# Altium schematic sheet SensorsAndOthers.SchDoc
size A3; DocumentNumber: 4; SheetNumber: 4; SheetTotal: 4
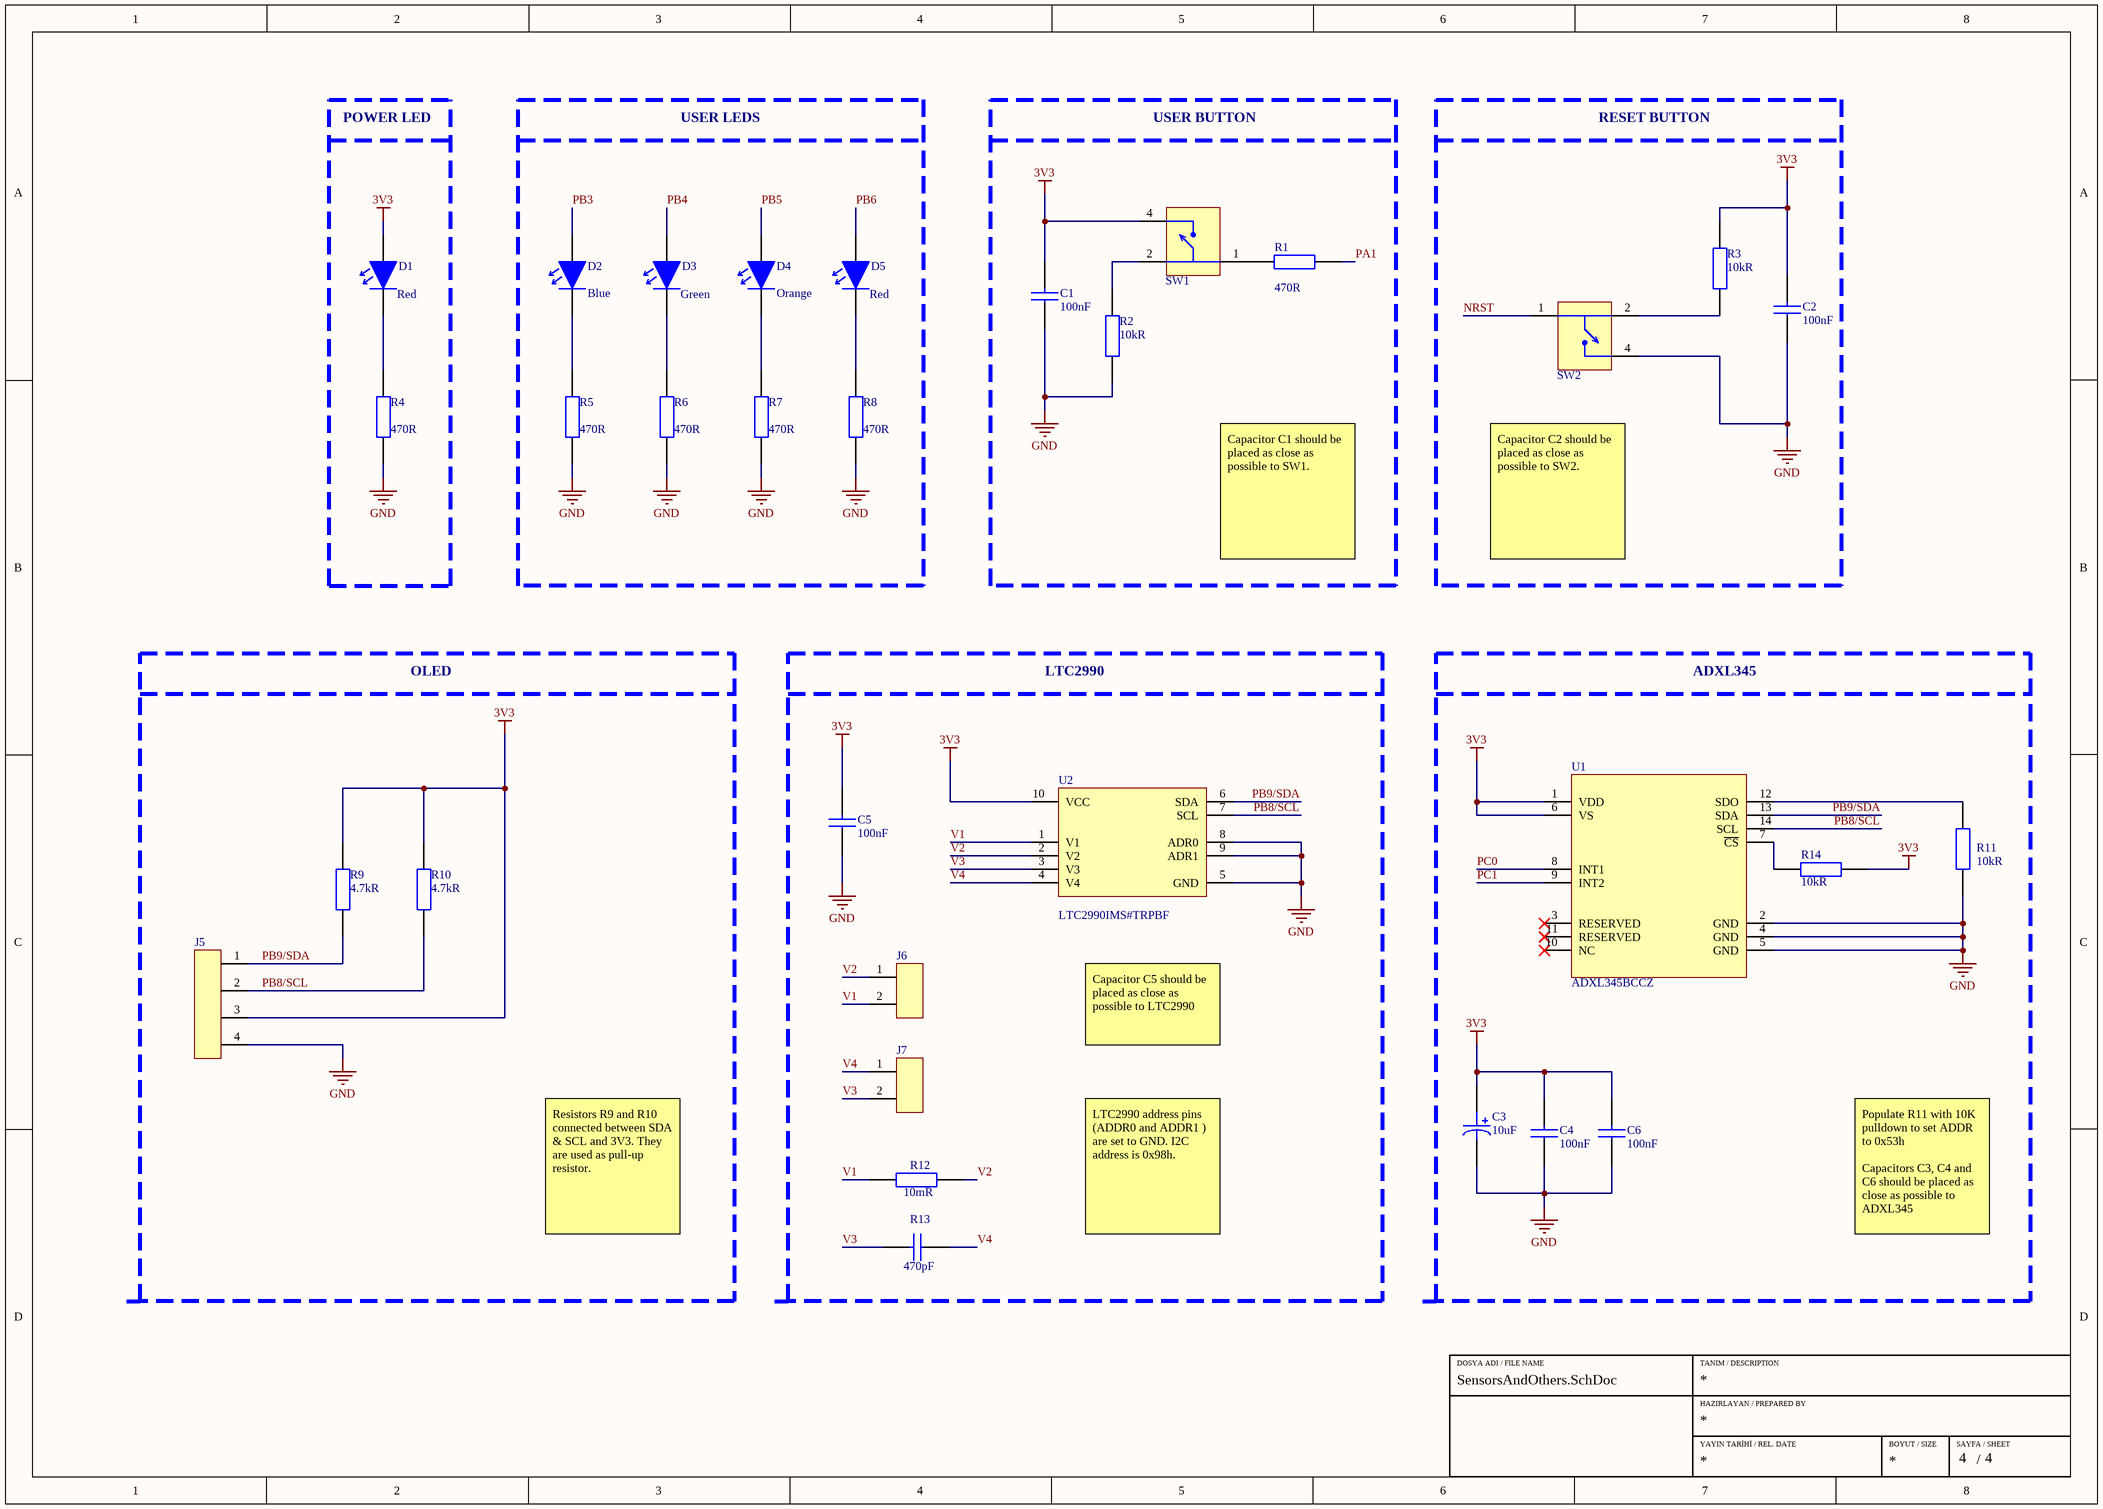
[diagram p0: SensorsAndOthers.SchDoc]

## Parts
C1  Capacitance: 100nF  [CAP_0805]  (hidden comment: CL21B104KBCNNNC)
C2  Capacitance: 100nF  [CAP_0805]  (hidden comment: CL21B104KBCNNNC)
C3  Capacitance: 10uF  [CAP_1206_TANT]  (hidden comment: T491A106K010AT)
C4  Capacitance: 100nF  [CAP_0805]  (hidden comment: CL21B104KBCNNNC)
C5  Capacitance: 100nF  [CAP_0805]  (hidden comment: CL21B104KBCNNNC)
C6  Capacitance: 100nF  [CAP_0805]  (hidden comment: CL21B104KBCNNNC)
D1  Color: Red  [LED_RED_0805]  (hidden comment: LH R974-LP-1)
D2  Color: Blue  [LED_BLUE_0805]  (hidden comment: 150080BS75000)
D3  Color: Green  [LED_GREEN_0805]  (hidden comment: LTST-C171GKT)
D4  Illumination Color: Orange  [LED_ORANGE_0805]  (hidden comment: LTST-C170KFKT)
D5  Color: Red  [LED_RED_0805]  (hidden comment: LH R974-LP-1)
J5  PPTC041LFBN-RC  [4x1 Female Header 2.54mm]  (value not drawn)
J6  282836-2  [TERMINAL]  (value not drawn)
J7  282836-2  [TERMINAL]  (value not drawn)
R1  Resistance: 470R  [RES_0805]  (hidden comment: RC0805FR-07470RL)
R2  Resistance: 10kR  [RES_0805]  (hidden comment: RC0805JR-0710KL)
R3  Resistance: 10kR  [RES_0805]  (hidden comment: RC0805JR-0710KL)
R4  Resistance: 470R  [RES_0805]  (hidden comment: RC0805FR-07470RL)
R5  Resistance: 470R  [RES_0805]  (hidden comment: RC0805FR-07470RL)
R6  Resistance: 470R  [RES_0805]  (hidden comment: RC0805FR-07470RL)
R7  Resistance: 470R  [RES_0805]  (hidden comment: RC0805FR-07470RL)
R8  Resistance: 470R  [RES_0805]  (hidden comment: RC0805FR-07470RL)
R9  Resistance: 4.7kR  [RES_0603]  (hidden comment: RC0603JR-074K7L)
R10  Resistance: 4.7kR  [RES_0603]  (hidden comment: RC0603JR-074K7L)
R11  Resistance: 10kR  [RES_0805]  (hidden comment: RC0805JR-0710KL)
R12  Resistance: 10mR  [RES_1206]  (hidden comment: RL1206FR-070R01L)
R13  Capacitance: 470pF  [CAP_0805]  (hidden comment: CC0805KRX7R9BB471)
R14  Resistance: 10kR  [RES_0603]  (hidden comment: RC0603FR-0710KL)
SW1  PTS815 SJK 250 SMTR LFS  [BUTTON SMD]  (value not drawn)
SW2  PTS815 SJK 250 SMTR LFS  [BUTTON SMD]  (value not drawn)
U1  ADXL345BCCZ  [14-VFLGA]
U2  LTC2990IMS#TRPBF  [MSOP-10]

## Blocks framed on the sheet
POWER LED: D1 R4
USER LEDS: D2-D5 R5-R8
USER BUTTON: C1 R1 R2 SW1
RESET BUTTON: C2 R3 SW2

## Nets
3V3: C1.2 C2.2 C3.1 C4.2 C5.2 C6.2 D1.2 J5.3 R3.2 R9.2 R10.2 R14.2 SW1.4 U1.1(VDD) U1.6(VS) U2.10(VCC)
GND: C1.1 C2.1 C3.2 C4.1 C5.1 C6.1 J5.4 R2.1 R4.1 R5.1 R6.1 R7.1 R8.1 R11.1 SW2.4 U1.2(GND) U1.4(GND) U1.5(GND) U2.5(GND) U2.8(ADR0) U2.9(ADR1)
NRST: SW2.1
PA1: R1.2
PB3: D2.2
PB4: D3.2
PB5: D4.2
PB6: D5.2
PB8/SCL: J5.2 R10.1 U1.14(SCL) U2.7(SCL)
PB9/SDA: J5.1 R9.1 U1.13(SDA) U2.6(SDA)
PC0: U1.8(INT1)
PC1: U1.9(INT2)
V1: J6.2 R12.2 U2.1(V1)
V2: J6.1 R12.1 U2.2(V2)
V3: J7.2 R13.2 U2.3(V3)
V4: J7.1 R13.1 U2.4(V4)
NetD1_1: D1.1 R4.2
NetD2_1: D2.1 R5.2
NetD3_1: D3.1 R6.2
NetD4_1: D4.1 R7.2
NetD5_1: D5.1 R8.2
NetR1_1: R1.1 SW1.1
NetR2_2: R2.2 SW1.2
NetR3_1: R3.1 SW2.2
NetR11_2: R11.2 U1.12(SDO)
NetR14_1: R14.1 U1.7(~{CS})

Not connected (* = marked no-connect by the designer): U1 3(RESERVED)* 10(NC)* 11(RESERVED)*

## Notes on the sheet
- Capacitor C1 should be placed as close as possible to SW1.
- Capacitor C2 should be placed as close as possible to SW2.
- OLED
- LTC2990
- ADXL345
- Capacitor C5 should be placed as close as possible to LTC2990
- Resistors R9 and R10 connected between SDA & SCL and 3V3. They are used as pull-up resistor.
- LTC2990 address pins (ADDR0 and ADDR1 ) are set to GND. I2C address is 0x98h.
- Populate R11 with 10K pulldown to set ADDR to 0x53h
  Capacitors C3, C4 and
  C6 should be placed as
  close as possible to
  ADXL345
- DOSYA ADI / FILE NAME
- TANIM / DESCRIPTION
- HAZIRLAYAN / PREPARED BY
- YAYIN TARİHİ / REL. DATE
- BOYUT / SIZE
- SAYFA / SHEET
- /

## Library data of the parts
C1 C2 C4-C6 = CAP CER 100nF 0805: CAP CER 100nF %10 0805; Manufacturer: Samsung; Designed by: BERK; Material: Ceramic; Tolerance: 10%; Dielectric: X7R; Voltage Rating: 50V; Supplier 1: Digi-Key; Manufacturer Part Number: CL21B104KBCNNNC; RoHS: Yes; Category: Ceramic Capacitors; Stock 1: 3371502; Pricing 1: 1=0,10000, 10=0,04700, 50=0,02560, 100=0,02090, 500=0,01494, 1000=0,01174 (USD); Mount: Surface Mount; Case/Package: 0805; Case Code (Metric): 2012; Case Code (Imperial): 0805; Contact Plating: Tin; Min Operating Temperature: -55°C; Max Operating Temperature: 125°C; Packaging: Tape and Reel; Voltage: 50V; Voltage Rating (DC): 50V; Series: CL; Construction: Flat; Length: 2mm; Width: 0.049inch; Height: 0.85mm; Depth: 1.25mm; Thickness: 0.037inch; Radiation Hardening: No; Lead Free: Lead Free; RoHS Compliant: Yes; ComponentLink1URL: https://datasheet.ciiva.com/25710/cl21b104kbcnnnc-25710182.pdf?src-supplier=Digi-Key; ComponentLink1Description: https://datasheet.ciiva.com/25710/cl21b104kbcnnnc-25710182.pdf?src-supplier=Digi-Key; ComponentLink2URL: https://datasheet.ciiva.com/29199/454152-da-01-en-vs-kondensator-0805-29199814.pdf?src-supplier=Conrad; ComponentLink2Description: https://datasheet.ciiva.com/29199/454152-da-01-en-vs-kondensator-0805-29199814.pdf?src-supplier=Conrad; Supplier Part Number 1: 1276-1003-1-ND
C3 = CAP TANT 10uF 1206: Cap Tant Solid 10uF 10V A CASE 10% (3.2 X 1.6 X 1.6mm) SMD 3216-18 4 Ohm 125 C T/R; Manufacturer: KEMET; Designed By: Aslı Kurt; Dielectric Material: Tantalum; ESR (Equivalent Series Resistance): 4R; Dissipation Factor: 6%; Ripple Current: 137mA; Leakage Current: 1uA; Polarity: Polar; Supplier 1: Digikey; Manufacturer Part Number: T491A106K010AT; RoHS: Yes; Category: Tantalum Capacitors; Stock 1: 1419669; Pricing 1: 1=0,32, 10=0,209, 50=0,154, 100=0,1255, 500=0,09904, 1000=0,08364 (USD); Mount: Surface Mount,PCB; Case/Package: 1206; Case Code (Metric): 3216; Case Code (Imperial): 1206; Min Operating Temperature: -55°C; Max Operating Temperature: 125°C; Voltage Rating: 10V; Tolerance: 10%; Packaging: Tape and Reel; Features: General Purpose; Series: T491; Voltage Rating (DC): 10V; Package Quantity: 1; Termination: SMD/SMT; Construction: Flat; Voltage: 10V; Length: 3.2mm; Width: 0.063inch; Height: 1.6mm; Height - Seated (Max): 0.071inch; Depth: 1.6mm; Size: 1.6mm; RoHS Compliant: Yes; Lead Free: 5697LeadFree; Reach SVHC Compliant: No; ComponentLink1URL: https://datasheet.ciiva.com/7668/1732743-7668006.pdf?src-supplier=Element14; ComponentLink1Description: https://datasheet.ciiva.com/7668/1732743-7668006.pdf?src-supplier=Element14; ComponentLink2URL: https://datasheet.ciiva.com/27052/1573249-27052559.pdf?src-supplier=Jameco; ComponentLink2Description: https://datasheet.ciiva.com/27052/1573249-27052559.pdf?src-supplier=Jameco; ComponentLink3URL: https://datasheet.ciiva.com/257/kem-t2005-t491-257584.pdf?src-supplier=Digikey; ComponentLink3Description: https://datasheet.ciiva.com/257/kem-t2005-t491-257584.pdf?src-supplier=Digikey; ComponentLink4URL: https://datasheet.ciiva.com/11793/0900766b80718482-11793106.pdf?src-supplier=Rs; ComponentLink4Description: https://datasheet.ciiva.com/11793/0900766b80718482-11793106.pdf?src-supplier=Rs; ComponentLink5URL: https://datasheet.ciiva.com/7668/kem-t2005-t491-7668139.pdf?src-supplier=Element14; ComponentLink5Description: https://datasheet.ciiva.com/7668/kem-t2005-t491-7668139.pdf?src-supplier=Element14; ComponentLink6URL: https://datasheet.ciiva.com/7668/1854511-7668007.pdf?src-supplier=Element14; ComponentLink6Description: https://datasheet.ciiva.com/7668/1854511-7668007.pdf?src-supplier=Element14; ComponentLink7URL: https://datasheet.ciiva.com/7668/1446014-7668008.pdf?src-supplier=Element14; ComponentLink7Description: https://datasheet.ciiva.com/7668/1446014-7668008.pdf?src-supplier=Element14; ComponentLink8URL: https://datasheet.ciiva.com/7668/1854511-7668005.pdf?src-supplier=Element14; ComponentLink8Description: https://datasheet.ciiva.com/7668/1854511-7668005.pdf?src-supplier=Element14; ComponentLink9URL: https://datasheet.ciiva.com/257/kem-t2005-t491-257585.pdf?src-supplier=Digikey; ComponentLink9Description: https://datasheet.ciiva.com/257/kem-t2005-t491-257585.pdf?src-supplier=Digikey; ComponentLink10URL: https://datasheet.ciiva.com/257/kem-t2005-t491-257586.pdf?src-supplier=Digikey; ComponentLink10Description: https://datasheet.ciiva.com/257/kem-t2005-t491-257586.pdf?src-supplier=Digikey; ComponentLink11URL: https://datasheet.ciiva.com/14586/70095774-14586699.pdf?src-supplier=Allied+Electronics; ComponentLink11Description: https://datasheet.ciiva.com/14586/70095774-14586699.pdf?src-supplier=Allied+Electronics; ComponentLink12URL: https://datasheet.ciiva.com/14596/70095774-14596972.pdf?src-supplier=Allied+Electronics; ComponentLink12Description: https://datasheet.ciiva.com/14596/70095774-14596972.pdf?src-supplier=Allied+Electronics; ComponentLink13URL: https://datasheet.ciiva.com/12882/kem-t2005-t491-12882826.pdf?src-supplier=Mouser; ComponentLink13Description: https://datasheet.ciiva.com/12882/kem-t2005-t491-12882826.pdf?src-supplier=Mouser; ComponentLink14URL: https://datasheet.ciiva.com/29244/458293-da-01-en-kondensator-10uf-3216-10pr-10v-85c-29244583.pdf?src-supplier=Conrad; ComponentLink14Description: https://datasheet.ciiva.com/29244/458293-da-01-en-kondensator-10uf-3216-10pr-10v-85c-29244583.pdf?src-supplier=Conrad; Supplier Part Number 1: 399-3684-1-ND
D1 D5 = LED RED 0805: LED Uni-Color Hyper Red 660nm 2-Pin Chip 0805(2012Metric) T/R; Manufacturer: Osram Opto; Lens Color: White; Forward Voltage: 1.8V; Lens Style: Diffused,Flat,Colorless; Luminous Intensity: 71mcd; Viewing Angle: 160°; Forward Current: 30mA; Dominant Wavelength: 645nm; Number of Elements: 1; Test Current: 20mA; Reverse Voltage: 5V; Lens Transparency: Diffused; Luminous Flux: 0.17lm; Lens Size: 1.25mm; Designed by: BERK; Supplier 1: Digi-Key; Manufacturer Part Number: LH R974-LP-1; RoHS: Yes; Category: LEDs; Stock 1: 35632; Pricing 1: 1=0,26000, 10=0,13900, 100=0,06480, 500=0,05978, 1000=0,04683, 2000=0,04584 (USD); Mount: Surface Mount; Case/Package: 0805; Number of Pins: 2; Case Code (Imperial): 0805; Case Code (Metric): 2012; Min Operating Temperature: -30°C; Max Operating Temperature: 85°C; Packaging: Tape and Reel; Illumination Color: Red; Package Quantity: 1; Series: CHipLED; Length: 2.1mm; Width: 1.25mm; Depth: 1.35mm; Radiation Hardening: No; RoHS Compliant: Yes; ComponentLink1URL: http://www.jameco.com/Jameco/Products/ProdDS/2085634.pdf?src-supplier=Jameco; ComponentLink1Description: http://www.jameco.com/Jameco/Products/ProdDS/2085634.pdf?src-supplier=Jameco; ComponentLink2URL: http://components.arrow.com/part/dataview/0323_01825492?src-supplier=Arrow+Europe; ComponentLink2Description: http://components.arrow.com/part/dataview/0323_01825492?src-supplier=Arrow+Europe; ComponentLink3URL: https://dammedia.osram.info/media/resource/hires/osram-dam-2493888/LH%20R974.pdf?src-supplier=Digi-Key; ComponentLink3Description: https://dammedia.osram.info/media/resource/hires/osram-dam-2493888/LH%20R974.pdf?src-supplier=Digi-Key; ComponentLink4URL: http://www.mouser.com/ds/2/311/LH%20R974%20-%20CHIPLED%200805-318659.pdf?src-supplier=Mouser; ComponentLink4Description: http://www.mouser.com/ds/2/311/LH%20R974%20-%20CHIPLED%200805-318659.pdf?src-supplier=Mouser; ComponentLink5URL: https://www.verical.com/server-webapp/html/getDatasheet?partID=258950&src-supplier=Verical; ComponentLink5Description: https://www.verical.com/server-webapp/html/getDatasheet?partID=258950&src-supplier=Verical; ComponentLink6URL: http://components.arrow.com/part/dataview/41971690S1077610N9133?src-supplier=Arrow+Electronics; ComponentLink6Description: http://components.arrow.com/part/dataview/41971690S1077610N9133?src-supplier=Arrow+Electronics; ComponentLink7URL: http://components.arrow.com/part/dataview/41971690S6190115N2128?src-supplier=Arrow+Electronics; ComponentLink7Description: http://components.arrow.com/part/dataview/41971690S6190115N2128?src-supplier=Arrow+Electronics; Supplier Part Number 1: 475-1415-1-ND
D2 = LED BLUE 0805: LED BLUE CLEAR 0805 SMD; Manufacturer: Wurth Electronics; Lens Color: Colorless; Luminous Intensity: 145mcd; Viewing Angle: 140°; Forward Voltage: 3.2V; Wavelength: 470nm; Lens Style: Clear,Flat,Rectangular; Forward Current: 30mA; Test Current: 20mA; Max Reverse Voltage (DC): 5V; Power Dissipation: 105mW; Lens Size: 1.25mm; Designed By: Aslı Kurt; Supplier 1: Digikey; Manufacturer Part Number: 150080BS75000; RoHS: Yes; Category: LEDs; Stock 1: 111917; Pricing 1: 1=0,18, 50=0,176, 100=0,151, 500=0,131, 4000=0,131 (USD); Mount: Surface Mount; Case/Package: 0805; Case Code (Metric): 2012; Case Code (Imperial): 0805; Min Operating Temperature: -40°C; Max Operating Temperature: 85°C; Package Quantity: 1; Packaging: Cut Tape; Dominant Wavelength: 470nm; Series: WL-SMCW; Lens Transparency: Clear; Reverse Voltage: 5V; Length: 2mm; Width: 1.25mm; Height: 0.8mm; Lead Free: Lead Free; RoHS Compliant: Yes; Reach SVHC Compliant: Unknown; ComponentLink1URL: https://datasheet.ciiva.com/22656/1740214-22656954.pdf?src-supplier=Element14; ComponentLink1Description: https://datasheet.ciiva.com/22656/1740214-22656954.pdf?src-supplier=Element14; ComponentLink2URL: https://datasheet.ciiva.com/23843/150080bs75000-23843251.pdf?src-supplier=Newark; ComponentLink2Description: https://datasheet.ciiva.com/23843/150080bs75000-23843251.pdf?src-supplier=Newark; ComponentLink3URL: https://datasheet.ciiva.com/29279/759433-da-01-en-chipled-0805-w-kl-blau-150080bs75000-29279203.pdf?src-supplier=Conrad; ComponentLink3Description: https://datasheet.ciiva.com/29279/759433-da-01-en-chipled-0805-w-kl-blau-150080bs75000-29279203.pdf?src-supplier=Conrad; ComponentLink4URL: https://datasheet.ciiva.com/29562/150080bs75000-29562923.pdf?src-supplier=Digikey; ComponentLink4Description: https://datasheet.ciiva.com/29562/150080bs75000-29562923.pdf?src-supplier=Digikey; ComponentLink5URL: https://datasheet.ciiva.com/29562/150080bs75000-29562922.pdf?src-supplier=Digikey; ComponentLink5Description: https://datasheet.ciiva.com/29562/150080bs75000-29562922.pdf?src-supplier=Digikey; Supplier Part Number 1: 732-4982-1-ND
D3 = LED GREEN 0805: Green 0805 130 º Min 5 mcd Typical 12 mcd Water Clear Lens SMT LED; Manufacturer: Vishay Lite-On; Designed by: BERK; Lens Color: Colorless; Viewing Angle: 130°; Lens Style: Diffused,Colorless,Rectangular,Clear; Luminous Intensity: 12mcd; Forward Current: 30mA; Forward Voltage: 2.1V; Power Rating: 100mW; Dominant Wavelength: 569nm; Test Current: 10mA; Number of Elements: 1; Wavelength: 585nm; Reverse Voltage: 5V; Supplier 1: Digi-Key; Manufacturer Part Number: LTST-C171GKT; RoHS: Yes; Category: LEDs; Stock 1: 159023; Pricing 1: 1=0,26000, 10=0,14100, 100=0,06560, 500=0,06060, 1000=0,04747 (USD); Mount: Surface Mount; Case/Package: 0805; Number of Pins: 2; Case Code (Metric): 2012; Case Code (Imperial): 0805; Min Operating Temperature: -55°C; Max Operating Temperature: 85°C; Package Quantity: 1; Packaging: Tape and Reel; Illumination Color: Green; Lens Transparency: Clear; Power Dissipation: 100mW; Number of LEDs: 1; Series: CHIPLED 0805; Length: 2mm; Width: 1.25mm; Height: 0.8mm; Depth: 1.25mm; Radiation Hardening: No; Lead Free: Lead Free; RoHS Compliant: Yes; ComponentLink1URL: https://datasheet.ciiva.com/2110/ltst-c171gkt-2110000.pdf?src-supplier=Digi-Key; ComponentLink1Description: https://datasheet.ciiva.com/2110/ltst-c171gkt-2110000.pdf?src-supplier=Digi-Key; ComponentLink2URL: https://datasheet.ciiva.com/11773/0900766b80dc0296-11773991.pdf?src-supplier=RSComponents; ComponentLink2Description: https://datasheet.ciiva.com/11773/0900766b80dc0296-11773991.pdf?src-supplier=RSComponents; ComponentLink3URL: https://datasheet.ciiva.com/12400/lite-on-ltst-c171gkt-190133-12400647.pdf?src-supplier=Mouser; ComponentLink3Description: https://datasheet.ciiva.com/12400/lite-on-ltst-c171gkt-190133-12400647.pdf?src-supplier=Mouser; ComponentLink4URL: https://datasheet.ciiva.com/2110/ltst-c171gkt-2110001.pdf?src-supplier=Digi-Key; ComponentLink4Description: https://datasheet.ciiva.com/2110/ltst-c171gkt-2110001.pdf?src-supplier=Digi-Key; ComponentLink5URL: https://datasheet.ciiva.com/2110/ltst-c171gkt-2110002.pdf?src-supplier=Digi-Key; ComponentLink5Description: https://datasheet.ciiva.com/2110/ltst-c171gkt-2110002.pdf?src-supplier=Digi-Key; ComponentLink6URL: https://datasheet.ciiva.com/16396/ltst-c171gkt-16396549.pdf?src-supplier=Future+Electronics; ComponentLink6Description: https://datasheet.ciiva.com/16396/ltst-c171gkt-16396549.pdf?src-supplier=Future+Electronics; Supplier Part Number 1: 160-1423-1-ND
D4 = LED ORANGE 0805: LED Uni-Color Orange 611nm 2-Pin Chip LED T/R / LED ORANGE CLEAR 0805 SMD; Manufacturer: Vishay Lite-On; Designed By: Aslı Kurt; Lens Color: Colorless; Luminous Intensity: 60mcd; Forward Current: 30mA; Viewing Angle: 130°; Forward Voltage: 2V; Lens Style: Diffused,Colorless,Rectangular,Clear; Power Rating: 75mW; Dominant Wavelength: 605nm; Test Current: 20mA; Number of Elements: 1; Reverse Voltage: 5V; Supplier 1: Digikey; Manufacturer Part Number: LTST-C170KFKT; RoHS: Yes; Category: LEDs; Stock 1: 367568; Pricing 1: 1=0,23, 10=0,127, 100=0,0762, 500=0,05646, 1000=0,05041 (USD); Mount: Surface Mount; Case/Package: 0805; Number of Pins: 2; Color: Orange; Case Code (Metric): 2012; Case Code (Imperial): 0805; Min Operating Temperature: -55°C; Max Operating Temperature: 85°C; Packaging: Tape and Reel; Package Quantity: 1; Lens Transparency: Clear; Power Dissipation: 75mW; Wavelength: 611nm; Number of LEDs: 1; Length: 3.2mm; Width: 1.25mm; Height: 1.1mm; Depth: 1.6mm; Radiation Hardening: No; Lead Free: Lead Free; RoHS Compliant: Yes; ComponentLink1URL: https://datasheet.ciiva.com/12403/lite-on-ltst-c170kfkt-187690-12403821.pdf?src-supplier=Mouser; ComponentLink1Description: https://datasheet.ciiva.com/12403/lite-on-ltst-c170kfkt-187690-12403821.pdf?src-supplier=Mouser; ComponentLink2URL: https://datasheet.ciiva.com/11773/0900766b80dc0279-11773662.pdf?src-supplier=Rs; ComponentLink2Description: https://datasheet.ciiva.com/11773/0900766b80dc0279-11773662.pdf?src-supplier=Rs; ComponentLink3URL: https://datasheet.ciiva.com/15117/getdatasheetpartid-158266-15117926.pdf?src-supplier=Verical; ComponentLink3Description: https://datasheet.ciiva.com/15117/getdatasheetpartid-158266-15117926.pdf?src-supplier=Verical; ComponentLink4URL: https://datasheet.ciiva.com/16427/ltst-c170kfkt-16427484.pdf?src-supplier=Future+Electronics; ComponentLink4Description: https://datasheet.ciiva.com/16427/ltst-c170kfkt-16427484.pdf?src-supplier=Future+Electronics; ComponentLink5URL: https://datasheet.ciiva.com/2110/s-110-ltst-c170kfkt-2110076.pdf?src-supplier=Digikey; ComponentLink5Description: https://datasheet.ciiva.com/2110/s-110-ltst-c170kfkt-2110076.pdf?src-supplier=Digikey; ComponentLink6URL: https://datasheet.ciiva.com/2110/s-110-ltst-c170kfkt-2110075.pdf?src-supplier=Digikey; ComponentLink6Description: https://datasheet.ciiva.com/2110/s-110-ltst-c170kfkt-2110075.pdf?src-supplier=Digikey; ComponentLink7URL: https://datasheet.ciiva.com/2110/s-110-ltst-c170kfkt-2110077.pdf?src-supplier=Digikey; ComponentLink7Description: https://datasheet.ciiva.com/2110/s-110-ltst-c170kfkt-2110077.pdf?src-supplier=Digikey; Supplier Part Number 1: 160-1413-1-ND
J5 = 4x1 Female Header 2.54mm: CONN HEADER FEMALE 4POS .1 TIN; Manufacturer: Sullins; Designed By: Aslı Kurt; Supplier 1: Digikey; Manufacturer Part Number: PPTC041LFBN-RC; RoHS: Yes; Category: Connectors; Stock 1: 27218; Pricing 1: 1=0,55, 10=0,415, 100=0,3181, 500=0,26578, 1000=0,24659, 5000=0,20864, 10000=0,2041 (USD); ComponentLink1URL: https://media.digikey.com/pdf/Data%20Sheets/Sullins%20PDFs/Female_Headers.100_DS.pdf?src-supplier=Digikey; ComponentLink1Description: https://media.digikey.com/pdf/Data%20Sheets/Sullins%20PDFs/Female_Headers.100_DS.pdf?src-supplier=Digikey; ComponentLink2URL: http://www.sullinscorp.com/catalogs/78_Page80-81_HEADER_.100_2.54mm_FEMALE.pdf?src-supplier=Future+Electronics; ComponentLink2Description: http://www.sullinscorp.com/catalogs/78_Page80-81_HEADER_.100_2.54mm_FEMALE.pdf?src-supplier=Future+Electronics; ComponentLink3URL: https://datasheet.octopart.com/PPTC041LFBN-RC-Sullins-datasheet-41308905.pdf?src-supplier=Future+Electronics; ComponentLink3Description: https://datasheet.octopart.com/PPTC041LFBN-RC-Sullins-datasheet-41308905.pdf?src-supplier=Future+Electronics; Supplier Part Number 1: S7002-ND
J6 J7 = 2x1 TERMINAL 5mm: Connector, Terminal Block; Wire Receptacle; 2 Pos.; 16-30 AWG; 0.197 in. CL; Sid; Manufacturer: TE Connectivity; Designed By: Aslı Kurt; Plating: Brass; Number of Positions: 2; Number of Levels: 1; Current: 13.5A; Voltage: 300V; Interlock: Yes (With); Screw Flange: No (Without); Connector System: 5937ConnectorSystem; Voltage Rating (DC): 250V; Pitch: 5mm; Wire Gauge (Max): 30AWG; Thread Size: M3; Tail Length: 3.5mm; Approvals: UL; Supplier 1: Digikey; Manufacturer Part Number: 282836-2; RoHS: Yes; Category: Terminal Blocks; Stock 1: 33835; Pricing 1: 1=0,6, 10=0,578, 25=0,576, 50=0,5566, 100=0,4666, 300=0,43743, 600=0,41315, 1200=0,36211, 5100=0,31593 (USD); Mount: Through Hole; Color: Green; Contact Material: Brass; Housing Color: Green; Contact Plating: Tin; Housing Material: Polyamide; Insulation Material: Nylon; Min Operating Temperature: -40°C; Max Operating Temperature: 105°C; Number of Rows: 1; Termination: Solder; Series: Buchanan; Packaging: Tray; Package Quantity: 300; Number of Positions Per Level: 2; Number of Contacts: 2; Orientation: Straight; Current Rating: 13.5A; Number of Circuits: 2; Screwless Terminal Block: No (Without); Side Stackable: Yes (With); Operating Supply Voltage: 300V; Voltage Rating: 300V; Max Voltage Rating (AC): 300V; Number of Poles: 2; Max Supply Voltage (AC): 300V; Connector Type: Receptacle; Closed End: No (Without); Max Current Rating: 13.5A; Length: 10.6mm; Width: 10mm; Wire Gauge (Min): 30AWG; Wire/Cable Gauge: 30AWG; Depth: 8.2mm; Radiation Hardening: No; Flammability Rating: UL94 V-0; RoHS Compliant: Yes; ELV: Compliant; Lead Free: Lead Free; Reach SVHC Compliant: Unknown; ComponentLink1URL: https://datasheet.ciiva.com/7628/1731782-7628513.pdf?src-supplier=Element14; ComponentLink1Description: https://datasheet.ciiva.com/7628/1731782-7628513.pdf?src-supplier=Element14; ComponentLink2URL: https://datasheet.ciiva.com/16393/282836-2-16393382.pdf?src-supplier=Future+Electronics; ComponentLink2Description: https://datasheet.ciiva.com/16393/282836-2-16393382.pdf?src-supplier=Future+Electronics; ComponentLink3URL: https://datasheet.ciiva.com/15169/getdatasheetpartid-155855-15169553.pdf?src-supplier=Verical; ComponentLink3Description: https://datasheet.ciiva.com/15169/getdatasheetpartid-155855-15169553.pdf?src-supplier=Verical; ComponentLink4URL: https://datasheet.ciiva.com/11757/0900766b8002dc8a-11757385.pdf?src-supplier=Rs; ComponentLink4Description: https://datasheet.ciiva.com/11757/0900766b8002dc8a-11757385.pdf?src-supplier=Rs; ComponentLink5URL: https://datasheet.ciiva.com/823/eng-cd-282836-h10-823437.pdf?src-supplier=Digikey; ComponentLink5Description: https://datasheet.ciiva.com/823/eng-cd-282836-h10-823437.pdf?src-supplier=Digikey; ComponentLink6URL: https://datasheet.ciiva.com/3141/eng-cs-1308389-eurostyle-terminal-blocks-0607-3141118.pdf?src-supplier=Avnet; ComponentLink6Description: https://datasheet.ciiva.com/3141/eng-cs-1308389-eurostyle-terminal-blocks-0607-3141118.pdf?src-supplier=Avnet; ComponentLink7URL: https://datasheet.ciiva.com/30261/eng-cs-1308389-eurostyle-terminal-blocks-0607-30261813.pdf?src-supplier=Onlinecomponents.com; ComponentLink7Description: https://datasheet.ciiva.com/30261/eng-cs-1308389-eurostyle-terminal-blocks-0607-30261813.pdf?src-supplier=Onlinecomponents.com; Supplier Part Number 1: A98076-ND
R1 R4-R8 = RES 470 OHM 0805: RES 470 OHM 1% 1/8W 0805; Manufacturer: Yageo; Voltage Rating (DC): 150V; Max Power Dissipation: 125mW; Temperature Coefficient: 100ppm/°C; Designed By: Aslı Kurt; Supplier 1: Digikey; Manufacturer Part Number: RC0805FR-07470RL; RoHS: Yes; Category: Chip SMD Resistors; Stock 1: 416993; Pricing 1: 1=0,1, 10=0,025, 50=0,016, 100=0,0133, 500=0,00912, 1000=0,00787 (USD); Case/Package: 0805; Number of Pins: 2; Case Code (Imperial): 0805; Case Code (Metric): 2012; Size Code: 0805; Min Operating Temperature: -55°C; Max Operating Temperature: 155°C; Tolerance: 1%; Packaging: Tape and Reel; Number of Terminations: 2; Series: RC; Features: Moisture Resistant; Package Quantity: 5000; Voltage Rating: 150V; Power Rating: 125mW; Termination: SMD/SMT; Resistor Type: Thick Film; Resistance Tolerance: 1%; Construction: Rectangular; Voltage Rating (AC): 150V; Length: 2mm; Width: 1.25mm; Height: 0.5mm; Depth: 1.25mm; Lead Pitch: 0.4mm; RoHS Compliant: Yes; Lead Free: Lead Free; Reach SVHC Compliant: Unknown; ComponentLink1URL: https://datasheet.ciiva.com/46447/444164-46447580.pdf?src-supplier=Element14; ComponentLink1Description: https://datasheet.ciiva.com/46447/444164-46447580.pdf?src-supplier=Element14; ComponentLink2URL: https://datasheet.ciiva.com/2457/pyu-r-int-thick-7-2457057.pdf?src-supplier=Digikey; ComponentLink2Description: https://datasheet.ciiva.com/2457/pyu-r-int-thick-7-2457057.pdf?src-supplier=Digikey; ComponentLink3URL: https://datasheet.ciiva.com/2457/pyu-r-int-thick-7-2457058.pdf?src-supplier=Digikey; ComponentLink3Description: https://datasheet.ciiva.com/2457/pyu-r-int-thick-7-2457058.pdf?src-supplier=Digikey; ComponentLink4URL: https://datasheet.ciiva.com/2457/pyu-r-int-thick-7-2457056.pdf?src-supplier=Digikey; ComponentLink4Description: https://datasheet.ciiva.com/2457/pyu-r-int-thick-7-2457056.pdf?src-supplier=Digikey; ComponentLink5URL: https://datasheet.ciiva.com/7941/444164-7941798.pdf?src-supplier=Element14; ComponentLink5Description: https://datasheet.ciiva.com/7941/444164-7941798.pdf?src-supplier=Element14; ComponentLink6URL: https://datasheet.ciiva.com/7941/444164-7941797.pdf?src-supplier=Element14; ComponentLink6Description: https://datasheet.ciiva.com/7941/444164-7941797.pdf?src-supplier=Element14; ComponentLink7URL: https://datasheet.ciiva.com/16745/rc0805-16745229.pdf?src-supplier=Future+Electronics; ComponentLink7Description: https://datasheet.ciiva.com/16745/rc0805-16745229.pdf?src-supplier=Future+Electronics; Supplier Part Number 1: 311-470CRCT-ND
R2 R3 R11 = RES 10K OHM 0805: RES 10K OHM 5% 1/8W 0805; Manufacturer: Yageo; Designed By: Aslı Kurt; Power Rating: 125mW; Temperature Coefficient: 100ppm/°C; Voltage Rating: 150V; Supplier 1: Digikey; Manufacturer Part Number: RC0805JR-0710KL; RoHS: Yes; Category: Chip SMD Resistors; Stock 1: 444162; Pricing 1: 1=0,1, 10=0,023, 50=0,0144, 100=0,012, 500=0,00818, 1000=0,00706 (USD); Case/Package: 0805; Contact Plating: Tin,Matte; Case Code (Imperial): 0805; Case Code (Metric): 2012; Size Code: 0805; Min Operating Temperature: -55°C; Max Operating Temperature: 155°C; Resistor Type: Thick Film; Tolerance: 5%; Packaging: Tape and Reel; Termination: SMD/SMT; Features: Moisture Resistant; Series: RC; Max Power Dissipation: 125mW; Number of Terminations: 2; Resistance Tolerance: 5%; Construction: Rectangular; Length: 2mm; Width: 1.25mm; Height: 0.5mm; Depth: 1.25mm; Radiation Hardening: No; RoHS Compliant: Yes; Military Standard: Not; Reach SVHC Compliant: Unknown; Lead Free: 5697LeadFree; ComponentLink1URL: https://datasheet.ciiva.com/7983/444164-7983765.pdf?src-supplier=Element14; ComponentLink1Description: https://datasheet.ciiva.com/7983/444164-7983765.pdf?src-supplier=Element14; ComponentLink2URL: https://datasheet.ciiva.com/7941/444164-7941870.pdf?src-supplier=Element14; ComponentLink2Description: https://datasheet.ciiva.com/7941/444164-7941870.pdf?src-supplier=Element14; ComponentLink3URL: https://datasheet.ciiva.com/7941/444164-7941871.pdf?src-supplier=Element14; ComponentLink3Description: https://datasheet.ciiva.com/7941/444164-7941871.pdf?src-supplier=Element14; Supplier Part Number 1: 311-10KARCT-ND
R9 R10 = RES 4K7 OHM 0603: RES 4K7 %5 OHM 0603 SMD; Manufacturer: Yageo; Tolerance: 5%; Temperature Coefficient: 100ppm/°C; Voltage Rating (DC): 50V; Power Rating: 100mW; Designed by: Aslı Kurt; Supplier 1: Digi-Key; Manufacturer Part Number: RC0603JR-074K7L; RoHS: Yes; Category: Chip SMD Resistors; Stock 1: 3901839; Pricing 1: 1=0,10000, 10=0,01900, 100=0,00770, 1000=0,00344, 2500=0,00298 (USD); Case/Package: 0603; Number of Pins: 2; Case Code (Imperial): 0603; Case Code (Metric): 1608; Size Code: 0603; Min Operating Temperature: -55°C; Max Operating Temperature: 155°C; Resistor Type: Thick Film; Packaging: Tape and Reel; Voltage Rating: 50V; Termination: SMD/SMT; Features: Moisture Resistant; Max Power Dissipation: 100mW; Number of Terminations: 2; Series: RC; Resistance Tolerance: 5%; Construction: Rectangular; Length: 1.6mm; Width: 0.8mm; Depth: 0.8mm; REACH SVHC: No SVHC; Lead Free: Lead Free; RoHS Compliant: Yes; Military Standard: Not; ComponentLink1URL: https://datasheet.ciiva.com/46412/443971-46412858.pdf?src-supplier=Element14; ComponentLink1Description: https://datasheet.ciiva.com/46412/443971-46412858.pdf?src-supplier=Element14; Supplier Part Number 1: 311-4.7KGRCT-ND
R12 = RES 10m OHM 1206: Res Thick Film 1206 0.01 Ohm 1% 0.25W(1/4W) ±1500ppm/C Pad SMD Automotive T/R; Manufacturer: Yageo; Designed By: Aslı Kurt; Supplier 1: Digikey; Manufacturer Part Number: RL1206FR-070R01L; RoHS: Yes; Category: Chip SMD Resistors; Stock 1: 37595; Pricing 1: 1=0,76, 10=0,403, 50=0,2764, 100=0,238, 500=0,1747, 1000=0,15476 (USD); ComponentLink1URL: https://datasheet.ciiva.com/5557/pyu-rl-hp-521-rohs-l-2-5557947.pdf?src-supplier=Mouser; ComponentLink1Description: https://datasheet.ciiva.com/5557/pyu-rl-hp-521-rohs-l-2-5557947.pdf?src-supplier=Mouser; Supplier Part Number 1: 311-0.01LWCT-ND
R13 = CAP CER 470pF 0805: CAP CER 470PF 50V X7R 0805; Manufacturer: Yageo; Designed By: Aslı Kurt; Dielectric Material: 4241ConductorMaterial; Supplier 1: Digikey; Manufacturer Part Number: CC0805KRX7R9BB471; RoHS: Yes; Category: Ceramic Capacitors; Stock 1: 102398; Pricing 1: 1=0,1, 10=0,067, 50=0,0398, 100=0,0314, 500=0,02316, 1000=0,01918 (USD); Voltage Rating (AC): 50V; Lead Free: 5697LeadFree; Halogen Free: 5694HalogenFree; ComponentLink1URL: https://datasheet.ciiva.com/29148/445173-da-01-en-kerko-chip-0805-x7r-470pf-10proz-50vg-29148961.pdf?src-supplier=Conrad; ComponentLink1Description: https://datasheet.ciiva.com/29148/445173-da-01-en-kerko-chip-0805-x7r-470pf-10proz-50vg-29148961.pdf?src-supplier=Conrad; ComponentLink2URL: https://datasheet.ciiva.com/46396/1489800-46396332.pdf?src-supplier=Element14; ComponentLink2Description: https://datasheet.ciiva.com/46396/1489800-46396332.pdf?src-supplier=Element14; ComponentLink3URL: https://datasheet.ciiva.com/15189/getdatasheetpartid-299872-15189229.pdf?src-supplier=Verical; ComponentLink3Description: https://datasheet.ciiva.com/15189/getdatasheetpartid-299872-15189229.pdf?src-supplier=Verical; ComponentLink4URL: https://datasheet.ciiva.com/144/mlccorderingcode-144598.pdf?src-supplier=Digikey; ComponentLink4Description: https://datasheet.ciiva.com/144/mlccorderingcode-144598.pdf?src-supplier=Digikey; ComponentLink5URL: https://datasheet.ciiva.com/144/mlccorderingcode-144599.pdf?src-supplier=Digikey; ComponentLink5Description: https://datasheet.ciiva.com/144/mlccorderingcode-144599.pdf?src-supplier=Digikey; ComponentLink6URL: https://datasheet.ciiva.com/144/mlccorderingcode-144600.pdf?src-supplier=Digikey; ComponentLink6Description: https://datasheet.ciiva.com/144/mlccorderingcode-144600.pdf?src-supplier=Digikey; Supplier Part Number 1: 311-1124-1-ND
R14 = RES 10K OHM 0603: RES 10K %1 OHM 0603 SMD; Manufacturer: Yageo; DesignedBy: Aslı Kurt; Tolerance: 1%; Temperature Coefficient: 100ppm/°C; Voltage Rating (DC): 50V; Power Rating: 100mW; Voltage Rating: 75V; Supplier 1: Digi-Key; Manufacturer Part Number: RC0603FR-0710KL; RoHS: Yes; Category: Chip SMD Resistors; Stock 1: 24140601; Pricing 1: 1=0,10000, 10=0,02300, 100=0,00930, 1000=0,00417, 2500=0,00362 (USD); Case/Package: 0603; Number of Pins: 2; Case Code (Imperial): 0603; Case Code (Metric): 1608; Weight: 7.1E-05oz; Size Code: 0603; Min Operating Temperature: -55°C; Max Operating Temperature: 155°C; Resistor Type: Thick Film; Packaging: Tape and Reel; Termination: SMD/SMT; Features: Moisture Resistant; Series: RC; Max Power Dissipation: 100mW; Number of Terminations: 2; Resistance Tolerance: 1%; Construction: Rectangular; Length: 1.6mm; Width: 0.8mm; Height: 0.45mm; Depth: 0.8mm; Lead Pitch: 0.3mm; REACH SVHC: Unknown; Lead Free: Lead Free; Military Standard: Not; RoHS Compliant: Yes; ComponentLink1URL: https://datasheet.ciiva.com/7660/38590-7660789.pdf?src-supplier=Element14; ComponentLink1Description: https://datasheet.ciiva.com/7660/38590-7660789.pdf?src-supplier=Element14; ComponentLink2URL: https://datasheet.ciiva.com/15189/getdatasheetpartid-409289-15189591.pdf?src-supplier=Verical; ComponentLink2Description: https://datasheet.ciiva.com/15189/getdatasheetpartid-409289-15189591.pdf?src-supplier=Verical; ComponentLink3URL: https://datasheet.ciiva.com/46440/1868787-46440891.pdf?src-supplier=Element14; ComponentLink3Description: https://datasheet.ciiva.com/46440/1868787-46440891.pdf?src-supplier=Element14; ComponentLink4URL: https://datasheet.ciiva.com/7983/443971-7983596.pdf?src-supplier=Element14; ComponentLink4Description: https://datasheet.ciiva.com/7983/443971-7983596.pdf?src-supplier=Element14; ComponentLink5URL: https://datasheet.ciiva.com/7746/1738695-7746239.pdf?src-supplier=Element14; ComponentLink5Description: https://datasheet.ciiva.com/7746/1738695-7746239.pdf?src-supplier=Element14; ComponentLink6URL: https://datasheet.ciiva.com/22747/443971-22747519.pdf?src-supplier=Element14; ComponentLink6Description: https://datasheet.ciiva.com/22747/443971-22747519.pdf?src-supplier=Element14; Supplier Part Number 1: 311-10.0KHRCT-ND
SW1 SW2 = 4.2mm x 3.2mm BUTTON: Microminiature Top Actuated Tactile Switch Momentary SPST-NO 50mA 12VDC Surface Mount T/R; Manufacturer: ITT C&K; Contact Resistance: 100mR; Number of Positions: 2NUMBER; Designed By: Aslı Kurt; Supplier 1: Digikey; Manufacturer Part Number: PTS815SJK250SMTRLFS; RoHS: Yes; Category: Tactile Switches; Stock 1: 21205; Pricing 1: 1=0,22, 10=0,208, 25=0,1972, 100=0,1786, 250=0,1628, 500=0,1513, 1000=0,12908 (USD); ComponentLink1URL: http://datasheet.octopart.com/PTS815SJK250SMTRLFS-C%26K-Components-datasheet-130077068.pdf?src-supplier=Mouser; ComponentLink1Description: http://datasheet.octopart.com/PTS815SJK250SMTRLFS-C%26K-Components-datasheet-130077068.pdf?src-supplier=Mouser; ComponentLink2URL: http://datasheet.octopart.com/PTS815SJK250SMTRLFS-C%26K-Components-datasheet-130077068.pdf?src-supplier=Newark; ComponentLink2Description: http://datasheet.octopart.com/PTS815SJK250SMTRLFS-C%26K-Components-datasheet-130077068.pdf?src-supplier=Newark; ComponentLink3URL: http://datasheet.octopart.com/PTS815SJK250SMTRLFS-C%26K-Components-datasheet-130077068.pdf?src-supplier=Allied+Electronics; ComponentLink3Description: http://datasheet.octopart.com/PTS815SJK250SMTRLFS-C%26K-Components-datasheet-130077068.pdf?src-supplier=Allied+Electronics; ComponentLink4URL: http://datasheet.octopart.com/PTS815SJK250SMTRLFS-C%26K-Components-datasheet-130077068.pdf?src-supplier=Onlinecomponents.com; ComponentLink4Description: http://datasheet.octopart.com/PTS815SJK250SMTRLFS-C%26K-Components-datasheet-130077068.pdf?src-supplier=Onlinecomponents.com; ComponentLink5URL: http://datasheet.octopart.com/PTS815SJK250SMTRLFS-C%26K-Components-datasheet-130077068.pdf?src-supplier=Verical; ComponentLink5Description: http://datasheet.octopart.com/PTS815SJK250SMTRLFS-C%26K-Components-datasheet-130077068.pdf?src-supplier=Verical; ComponentLink6URL: http://datasheet.octopart.com/PTS815SJK250SMTRLFS-C%26K-Components-datasheet-130077068.pdf?src-supplier=Future+Electronics; ComponentLink6Description: http://datasheet.octopart.com/PTS815SJK250SMTRLFS-C%26K-Components-datasheet-130077068.pdf?src-supplier=Future+Electronics; ComponentLink7URL: http://datasheet.octopart.com/PTS815SJK250SMTRLFS-C%26K-Components-datasheet-130077068.pdf?src-supplier=Digikey; ComponentLink7Description: http://datasheet.octopart.com/PTS815SJK250SMTRLFS-C%26K-Components-datasheet-130077068.pdf?src-supplier=Digikey; ComponentLink8URL: http://datasheet.octopart.com/PTS815SJK250SMTRLFS-C%26K-Components-datasheet-130077068.pdf?src-supplier=Avnet; ComponentLink8Description: http://datasheet.octopart.com/PTS815SJK250SMTRLFS-C%26K-Components-datasheet-130077068.pdf?src-supplier=Avnet; ComponentLink9URL: http://datasheet.octopart.com/PTS815SJK250SMTRLFS-C%26K-Components-datasheet-130077068.pdf?src-supplier=Sager+Electronics; ComponentLink9Description: http://datasheet.octopart.com/PTS815SJK250SMTRLFS-C%26K-Components-datasheet-130077068.pdf?src-supplier=Sager+Electronics; ComponentLink10URL: http://datasheet.octopart.com/PTS815SJK250SMTRLFS-C%26K-Components-datasheet-130077068.pdf?src-supplier=NAC+Semi; ComponentLink10Description: http://datasheet.octopart.com/PTS815SJK250SMTRLFS-C%26K-Components-datasheet-130077068.pdf?src-supplier=NAC+Semi; ComponentLink11URL: http://datasheet.octopart.com/PTS815SJK250SMTRLFS-C%26K-Components-datasheet-130077068.pdf?src-supplier=LCSC; ComponentLink11Description: http://datasheet.octopart.com/PTS815SJK250SMTRLFS-C%26K-Components-datasheet-130077068.pdf?src-supplier=LCSC; ComponentLink12URL: http://datasheet.octopart.com/PTS815SJK250SMTRLFS-C%26K-Components-datasheet-130077068.pdf?src-supplier=Electro+Sonic; ComponentLink12Description: http://datasheet.octopart.com/PTS815SJK250SMTRLFS-C%26K-Components-datasheet-130077068.pdf?src-supplier=Electro+Sonic; ComponentLink13URL: http://datasheet.octopart.com/PTS815SJK250SMTRLFS-C%26K-Components-datasheet-130077068.pdf?src-supplier=TTI; ComponentLink13Description: http://datasheet.octopart.com/PTS815SJK250SMTRLFS-C%26K-Components-datasheet-130077068.pdf?src-supplier=TTI; ComponentLink14URL: https://datasheet.octopart.com/PTS815SJK250SMTRLFS-C%26K-Components-datasheet-166147782.pdf?src-supplier=TME; ComponentLink14Description: https://datasheet.octopart.com/PTS815SJK250SMTRLFS-C%26K-Components-datasheet-166147782.pdf?src-supplier=TME; Supplier Part Number 1: CKN12216-1-ND
U1 = ADXL345BCCZ: Analog Devices - ADXL345BCCZ - Mems Accelerometer, 3-AXIS, Digital, X, Y, Z, ± 2G, ± 4G, ± 8G, ± 16G, 2 V, 3.6 V, LGA; Designed By: Aslı Kurt; Max Supply Voltage: 3.6V; Min Supply Voltage: 2V; Bandwidth: 0.05Hz; -3db Bandwidth: 1.6kHz; Nominal Supply Current: 140uA; Operating Supply Current: 145uA; Axis: X, Y, Z; Sensitivity: 282mV/g; Supplier 1: Digikey; Manufacturer: Analog Devices; Manufacturer Part Number: ADXL345BCCZ; RoHS: Yes; Category: Accelerometers; Stock 1: 26255; Pricing 1: 1=8,76, 5=7,384, 10=6,862, 25=6,2276, 40=5,9255, 157=5,12803, 471=4,56628, 1099=4,17569 (USD); Case/Package: LGA; Number of Pins: 14; Contact Plating: Gold; Min Operating Temperature: -40°C; Max Operating Temperature: 85°C; Package Quantity: 490; Packaging: Tray; Output Type: Digital; Series: -; Supply Current: 140uA; Length: 5mm; Width: 3mm; Height: 0.98mm; Depth: 3mm; Radiation Hardening: No; Lead Free: Contains Lead; RoHS Compliant: Yes; Reach SVHC Compliant: No; ComponentLink1URL: https://datasheet.ciiva.com/5786/adxl345-5786432.pdf?src-supplier=Farnell; ComponentLink1Description: https://datasheet.ciiva.com/5786/adxl345-5786432.pdf?src-supplier=Farnell; ComponentLink2URL: https://datasheet.ciiva.com/15099/getdatasheetpartid-112906-15099657.pdf?src-supplier=Verical; ComponentLink2Description: https://datasheet.ciiva.com/15099/getdatasheetpartid-112906-15099657.pdf?src-supplier=Verical; ComponentLink3URL: https://datasheet.ciiva.com/1577/adxl345-1577555.pdf?src-supplier=Farnell; ComponentLink3Description: https://datasheet.ciiva.com/1577/adxl345-1577555.pdf?src-supplier=Farnell; ComponentLink4URL: https://datasheet.ciiva.com/1165/1793774-1165508.pdf?src-supplier=Element14; ComponentLink4Description: https://datasheet.ciiva.com/1165/1793774-1165508.pdf?src-supplier=Element14; ComponentLink5URL: https://datasheet.ciiva.com/1165/1793774-1165507.pdf?src-supplier=Element14; ComponentLink5Description: https://datasheet.ciiva.com/1165/1793774-1165507.pdf?src-supplier=Element14; ComponentLink6URL: https://datasheet.ciiva.com/3271/adxl345-ep-3271527.pdf?src-supplier=Avnet; ComponentLink6Description: https://datasheet.ciiva.com/3271/adxl345-ep-3271527.pdf?src-supplier=Avnet; ComponentLink7URL: https://datasheet.ciiva.com/2809/adxl345-2809950.pdf?src-supplier=Digikey; ComponentLink7Description: https://datasheet.ciiva.com/2809/adxl345-2809950.pdf?src-supplier=Digikey; Supplier Part Number 1: 505-ADXL345BCCZ-ND
U2 = LTC2990IMS#TRPBF: Ms-System Monitor/Other I2c Temperature, Voltage And Current Monitor; Manufacturer: Analog Devices / Linear Technology; Designed By: Aslı Kurt; Supplier 1: Digikey; Manufacturer Part Number: LTC2990IMS#TRPBF; RoHS: Yes; Category: Amplifiers - Op Amps, Buffer, Instrumentation; Stock 1: 9119; Pricing 1: 1=9,28, 10=6,417, 25=5,6784, 100=4,8527, 250=4,45248, 500=4,2087, 1000=4,00633 (USD); Case/Package: MSOP; Number of Pins: 10; Min Operating Temperature: -40°C; Max Operating Temperature: 85°C; Package Quantity: 2500; Packaging: Tape and Reel; Output Type: I2C; Length: 3mm; Height: 0.86mm; RoHS Compliant: Yes; ComponentLink1URL: https://datasheet.ciiva.com/2003/29813-2003915.pdf?src-supplier=Digikey; ComponentLink1Description: https://datasheet.ciiva.com/2003/29813-2003915.pdf?src-supplier=Digikey; Supplier Part Number 1: 505-LTC2990IMS#TRPBFCT-ND